# Altium project EBS_MainBoard.PrjPcb
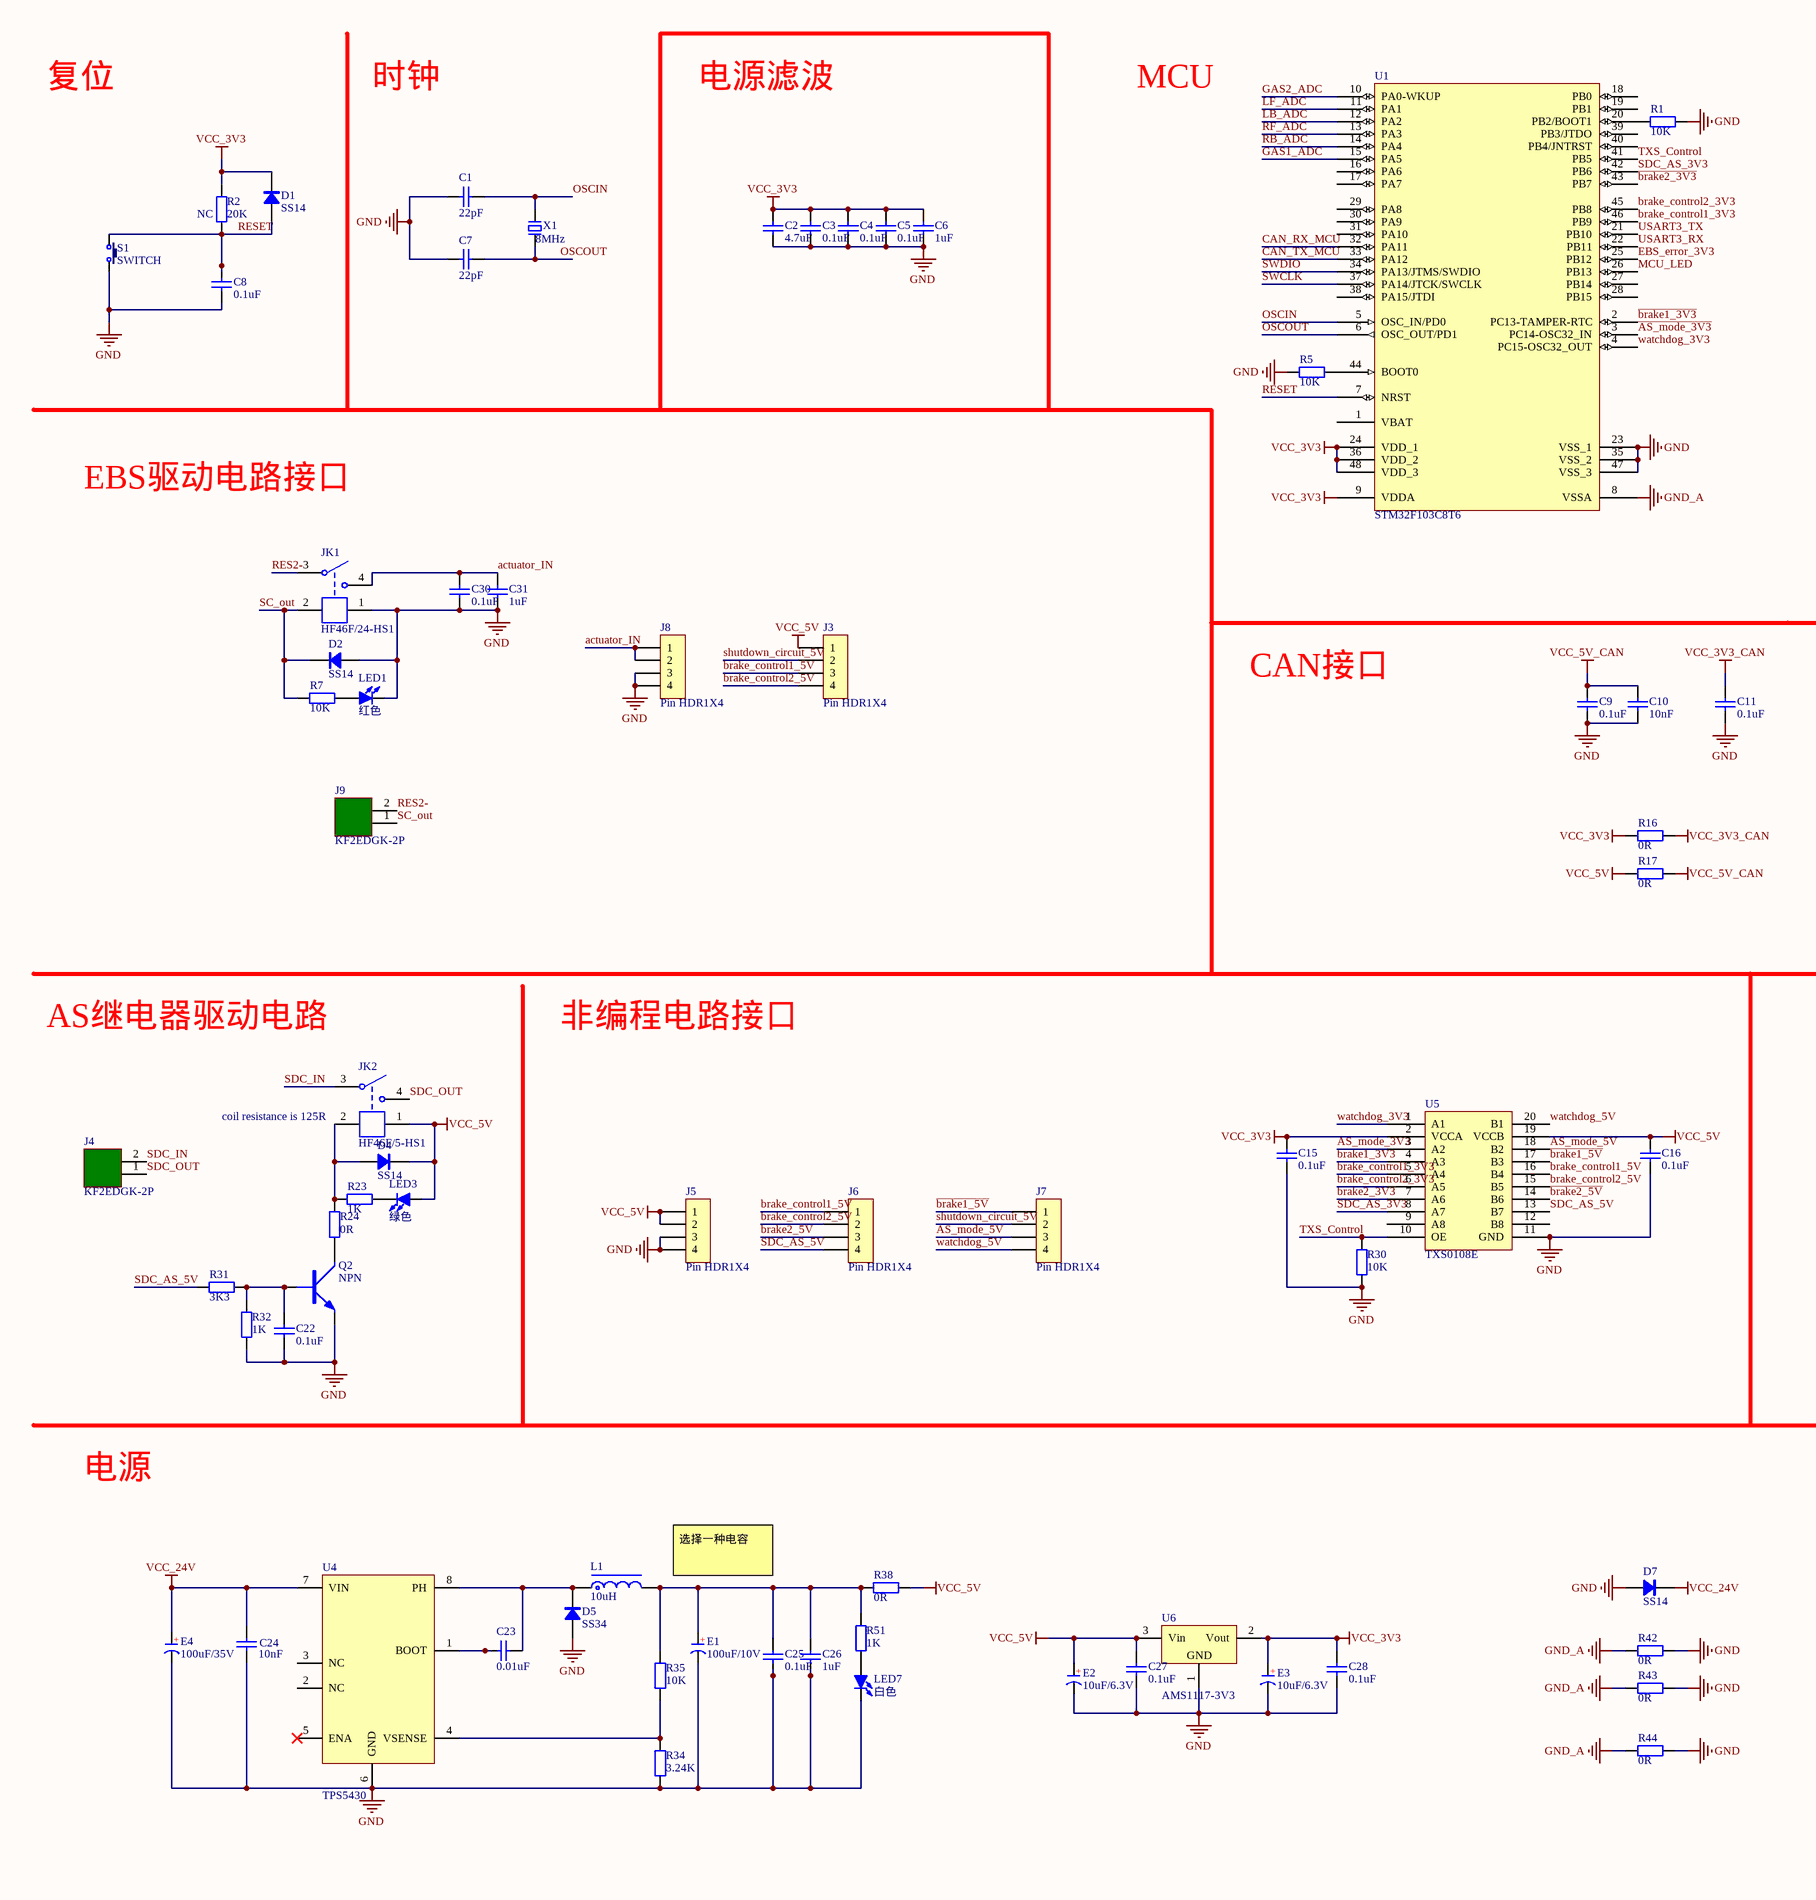
[diagram p0: HRT_23D_EBS1.1.SchDoc, left]
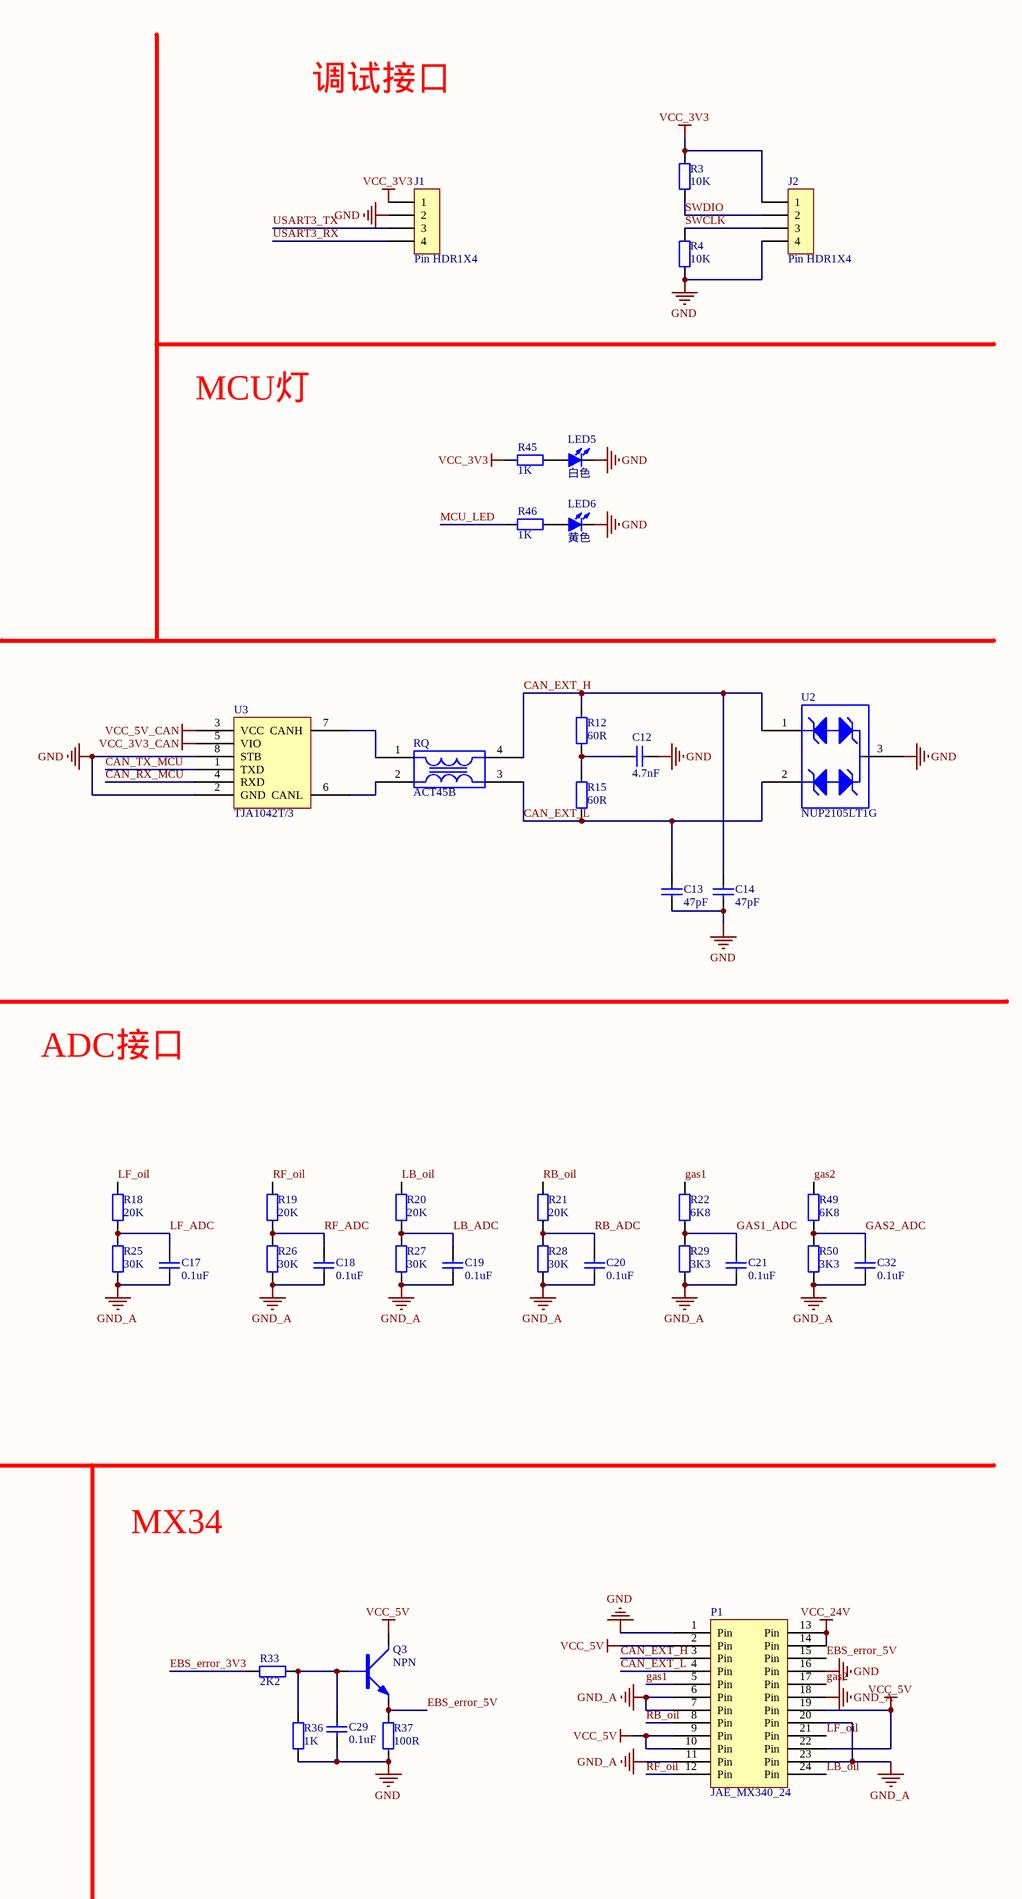
[diagram p1: HRT_23D_EBS1.1.SchDoc, right]
1 sheet, 109 parts. Net scope: global (net labels, ports and power ports of the same name join across sheets).
Board file: HRT_23D_EBS1.1.PcbDoc

## Sheet HRT_23D_EBS1.1.SchDoc
size A2

### Parts
C1  22pF  [C 0805_M]
C2  4.7uF  [C 0805_M]
C3  0.1uF  [C 0805_M]
C4  0.1uF  [C 0805_M]
C5  0.1uF  [C 0805_M]
C6  1uF  [C 0805_M]
C7  22pF  [C 0805_M]
C8  0.1uF  [C 0805_M]
C9  0.1uF  [C 0805_M]
C10  10nF  [C 0805_M]
C11  0.1uF  [C 0805_M]
C12  4.7nF  [C 0805_M]
C13  47pF  [C 0805_M]
C14  47pF  [C 0805_M]
C15  0.1uF  [C 0805_M]
C16  0.1uF  [C 0805_M]
C17  0.1uF  [C 0805_M]
C18  0.1uF  [C 0805_M]
C19  0.1uF  [C 0805_M]
C20  0.1uF  [C 0805_M]
C21  0.1uF  [C 0805_M]
C22  0.1uF  [C 0805_M]
C23  0.01uF  [C 0805_M]
C24  10nF  [C 0805_M]
C25  0.1uF  [C 0805_M]
C26  1uF  [C 0805_M]
C27  0.1uF  [C 0805_M]
C28  0.1uF  [C 0805_M]
C29  0.1uF  [C 0805_M]
C30  0.1uF  [C 0805_M]
C31  1uF  [C 0805_M]
C32  0.1uF  [C 0805_M]
D1  SS14  [SMA]
D2  SS14  [SMA]
D4  SS14  [SMA]
D5  SS34  [SMA]
D7  SS14  [SMA]
E1  100uF/10V  [CM C(5*5.4)]
E2  10uF/6.3V  [CD A(3216)]
E3  10uF/6.3V  [CD A(3216)]
E4  100uF/35V  [CM D(6.3*7.7)]
J1  Pin HDR1X4  [Pin HDR1X4/2.54mm-S]
J2  Pin HDR1X4  [Pin HDR1X4/2.54mm-S]
J3  Pin HDR1X4  [Fe-HDR1X4/2.54-S]
J4  KF2EDGK-2P  [KF2EDGK5.08W-2P]
J5  Pin HDR1X4  [Fe-HDR1X4/2.54-S]
J6  Pin HDR1X4  [Fe-HDR1X4/2.54-S]
J7  Pin HDR1X4  [Fe-HDR1X4/2.54-S]
J8  Pin HDR1X4  [Fe-HDR1X4/2.54-S]
J9  KF2EDGK-2P  [KF2EDGK5.08W-2P]
JK1  HF46F/24-HS1  [HF46-xx-HS1]
JK2  HF46F/5-HS1  [HF46-xx-HS1]
L1  10uH  [SMD 12*12*8mm]
LED1  红色  [LED 0805R]
LED3  绿色  [LED 0805G]
LED5  白色  [LED 0805W]
LED6  黄色  [LED 0805Y]
LED7  白色  [LED 0805W]
P1  JAE_MX340_24  [JAE_MX34_2.2_24 - duplicate]
Q2  NPN  [SOT-23]
Q3  NPN  [SOT-23]
R1  10K  [0805R]
R2  20K  [0805R]
R3  10K  [0805R]
R4  10K  [0805R]
R5  10K  [0805R]
R7  10K  [0805R]
R12  60R  [0805R]
R15  60R  [0805R]
R16  0R  [0805R]
R17  0R  [0805R]
R18  20K  [0805R]
R19  20K  [0805R]
R20  20K  [0805R]
R21  20K  [0805R]
R22  6K8  [0805R]
R23  1K  [0805R]
R24  0R  [0805R]
R25  30K  [0805R]
R26  30K  [0805R]
R27  30K  [0805R]
R28  30K  [0805R]
R29  3K3  [0805R]
R30  10K  [0805R]
R31  3K3  [0805R]
R32  1K  [0805R]
R33  2K2  [0805R]
R34  3.24K  [0805R]
R35  10K  [0805R]
R36  1K  [0805R]
R37  100R  [0805R]
R38  0R  [1206R]
R42  0R  [0805R]
R43  0R  [0805R]
R44  0R  [0805R]
R45  1K  [0805R]
R46  1K  [0805R]
R49  6K8  [0805R]
R50  3K3  [0805R]
R51  1K  [0805R]
RQ  ACT45B  [4532]
S1  SWITCH  [TSW SMD-3*6*2.5]
U1  STM32F103C8T6  [LQFP48 7X7]
U2  NUP2105LT1G  [SOT-23-3P]
U3  TJA1042T/3  [SOP8]
U4  TPS5430  [SOP8-Pad]
U5  TXS0108E  [SSOP20]
U6  AMS1117-3V3  [SOT223_M]
X1  8MHz  [OSC 5032-2P]

### Nets
GND: C1.1 C2.1 C3.1 C4.1 C5.1 C6.1 C7.1 C8.1 C9.1 C10.1 C11.1 C12.1 C13.2 C14.2 C15.2 C16.2 C22.2 C24.2 C25.2 C26.2 C27.2 C28.2 C29.2 C30.2 C31.2 D2.1(A) D5.1(A) D7.1(A) E1.2(K) E2.1(K) E3.1(K) E4.2(K) J1.2 J2.4 J5.3 J5.4 J8.3 J8.4 JK1.1 LED1.2(K) LED5.2(K) LED6.2(K) LED7.2(K) P1.1(Pin) P1.16(Pin) Q2.E R1.1 R4.1 R5.1 R30.1 R32.1 R34.1 R36.1 R37.1 R42.1 R43.1 R44.1 S1.2 U1.23(VSS_1) U1.35(VSS_2) U1.47(VSS_3) U2.3 U3.2(GND) U3.8(STB) U4.6(GND) U5.11(GND) U6.1(GND)
GND_A: C17.2 C18.2 C19.2 C20.2 C21.2 C32.2 P1.6(Pin) P1.7(Pin) P1.11(Pin) P1.18(Pin) P1.20(Pin) P1.23(Pin) R25.1 R26.1 R27.1 R28.1 R29.1 R42.2 R43.2 R44.2 R50.1 U1.8(VSSA)
VCC_3V3: C2.2 C3.2 C4.2 C5.2 C6.2 C15.1 C28.1 D1.2(K) E3.2(A) J1.1 J2.1 R2.2 R3.2 R16.1 R45.2 U1.9(VDDA) U1.24(VDD_1) U1.36(VDD_2) U1.48(VDD_3) U5.2(VCCA) U6.2(Vout)
VCC_3V3_CAN: C11.2 R16.2 U3.5(VIO)
VCC_5V: C16.1 C27.1 D4.2(K) E2.2(A) J3.1 J5.1 J5.2 JK2.1 LED3.1(A) P1.2(Pin) P1.9(Pin) P1.10(Pin) P1.19(Pin) P1.22(Pin) Q3.C R17.1 R38.1 U5.19(VCCB) U6.3(Vin)
VCC_5V_CAN: C9.2 C10.2 R17.2 U3.3(VCC)
VCC_24V: C24.1 D7.2(K) E4.1(A) P1.13(Pin) P1.14(Pin) U4.7(VIN)
~{AS_mode_3V3}: U1.3(PC14-OSC32_IN) U5.3(A2)
~{AS_mode_5V}: J7.3 U5.18(B2)
actuator_IN: C30.1 C31.1 J8.1 J8.2 JK1.4
~{brake1_3V3}: U1.2(PC13-TAMPER-RTC) U5.4(A3)
~{brake1_5V}: J7.1 U5.17(B3)
~{brake2_3V3}: U1.43(PB7) U5.7(A6)
~{brake2_5V}: J6.3 U5.14(B6)
brake_control1_3V3: U1.46(PB9) U5.5(A4)
brake_control1_5V: J3.3 J6.1 U5.16(B4)
brake_control2_3V3: U1.45(PB8) U5.6(A5)
brake_control2_5V: J3.4 J6.2 U5.15(B5)
CAN_EXT_H: C14.1 P1.3(Pin) R12.2 RQ.4 U2.1
CAN_EXT_L: C13.1 P1.4(Pin) R15.1 RQ.3 U2.2
CAN_RX_MCU: U1.32(PA11) U3.4(RXD)
CAN_TX_MCU: U1.33(PA12) U3.1(TXD)
EBS_error_3V3: R33.2 U1.25(PB12)
EBS_error_5V: P1.15(Pin) Q3.E R37.2
gas1: P1.5(Pin) R22.2
GAS1_ADC: C21.1 R22.1 R29.2 U1.15(PA5)
gas2: P1.17(Pin) R49.2
GAS2_ADC: C32.1 R49.1 R50.2 U1.10(PA0-WKUP)
LB_ADC: C19.1 R20.1 R27.2 U1.12(PA2)
LB_oil: P1.24(Pin) R20.2
LF_ADC: C17.1 R18.1 R25.2 U1.11(PA1)
LF_oil: P1.21(Pin) R18.2
MCU_LED: R46.2 U1.26(PB13)
OSCIN: C1.2 U1.5(OSC_IN/PD0) X1.1
OSCOUT: C7.2 U1.6(OSC_OUT/PD1) X1.2
RB_ADC: C20.1 R21.1 R28.2 U1.14(PA4)
RB_oil: P1.8(Pin) R21.2
RES2-: J9.2 JK1.3
RESET: C8.2 D1.1(A) R2.1 S1.1 U1.7(NRST)
RF_ADC: C18.1 R19.1 R26.2 U1.13(PA3)
RF_oil: P1.12(Pin) R19.2
SC_out: D2.2(K) J9.1 JK1.2 R7.2
SDC_AS_3V3: U1.42(PB6) U5.8(A7)
SDC_AS_5V: J6.4 R31.2 U5.13(B7)
SDC_IN: J4.2 JK2.3
SDC_OUT: J4.1 JK2.4
shutdown_circuit_5V: J3.2 J7.2
SWCLK: J2.3 R4.2 U1.37(PA14/JTCK/SWCLK)
SWDIO: J2.2 R3.1 U1.34(PA13/JTMS/SWDIO)
TXS_Control: R30.2 U1.41(PB5) U5.10(OE)
USART3_RX: J1.4 U1.22(PB11)
USART3_TX: J1.3 U1.21(PB10)
watchdog_3V3: U1.4(PC15-OSC32_OUT) U5.1(A1)
watchdog_5V: J7.4 U5.20(B1)
NetC12_2: C12.2 R12.1 R15.2
NetC22_1: C22.1 Q2.B R31.1 R32.2
NetC23_1: C23.1 U4.1(BOOT)
NetC23_2: C23.2 D5.2(K) L1.1 U4.8(PH)
NetC25_1: C25.1 C26.1 E1.1(A) L1.2 R35.2 R38.2 R51.2
NetC29_1: C29.1 Q3.B R33.1 R36.2
NetD4_1: D4.1(A) JK2.2 R23.2 R24.1
NetLED1_1: LED1.1(A) R7.1
NetLED3_2: LED3.2(K) R23.1
NetLED5_1: LED5.1(A) R45.1
NetLED6_1: LED6.1(A) R46.1
NetLED7_1: LED7.1(A) R51.1
NetQ2_C: Q2.C R24.2
NetR1_2: R1.2 U1.20(PB2/BOOT1)
NetR5_2: R5.2 U1.44(BOOT0)
NetR34_2: R34.2 R35.1 U4.4(VSENSE)
NetRQ_1: RQ.1 U3.7(CANH)
NetRQ_2: RQ.2 U3.6(CANL)

Not connected (* = marked no-connect by the designer): U1 1(VBAT) 16(PA6) 17(PA7) 18(PB0) 19(PB1) 27(PB14) 28(PB15) 29(PA8) 30(PA9) 31(PA10) 38(PA15/JTDI) 39(PB3/JTDO) 40(PB4/JNTRST); U4 2(NC) 3(NC) 5(ENA)*; U5 9(A8) 12(B8)

### Notes on the sheet
- 复位
- 时钟
- 电源滤波
- MCU
- 调试接口
- (near R2) NC
- MCU灯
- EBS驱动电路接口
- CAN接口
- AS继电器驱动电路
- 非编程电路接口
- ADC接口
- (near JK2) coil resistance is 125R
- 电源
- MX34
- (near L1) 选择一种电容
- (in symbol C-CD) +
- (in symbol C-CM) +

### Library data of the parts
C1-C32 = C: 无极性贴片电容
D1 D2 D4 D7 = SS14: 肖特基二极管; 版权归属: 源创客; 属性: 40V/1A; BOM名称: 肖特基二极管; 学习资源: www.ooocke.com
D5 = SS34: 肖特基二极管; 版权归属: 源创客; 属性: 40V/3A; BOM名称: 肖特基二极管; 学习资源: www.ooocke.com
E1 E4 = C-CM: 贴片电解电容 / ESR < 0.04R; 版权归属: 源创客; BOM名称: 贴片电解电容; 学习资源: www.ooocke.com
E2 E3 = C-CD: 贴片钽电容; 版权归属: 源创客; BOM名称: 贴片钽电容; 学习资源: www.ooocke.com
JK1 = HF46F/24-HS1: 24V一组常开继电器; BOM名称: 24V继电器; 版权归属: 源创客; 学习资源: www.ooocke.com
JK2 = HF46F/5-HS1: 5V一组常开; BOM名称: 5V继电器; 版权归属: 源创客; 学习资源: www.ooocke.com
L1 = L-CD: 贴片功率电感; BOM名称: 功率电感; 版权归属: 源创客; 学习资源: www.ooocke.com
LED1 LED3 LED5-LED7 = LED-SMD: 贴片LED; 版权归属: 源创客; BOM名称: 贴片LED; 学习资源: www.ooocke.com
P1 = JAE_MX34024NF1
Q2 Q3 = NPN: NPN三极管
R1-R5 R7 R12 R15-R38 R42-R46 R49-R51 = RES: 贴片电阻
RQ = ACT45B: 共模电感
S1 = SWITCH: 按键
U2 = NUP2105LT1G: 静电管
U3 = TJA1042T/3: 高速CAN收发器
U4 = TPS5430: DCDC降压芯片
U6 = AMS1117: 三端稳压芯片; BOM名称: 稳压芯片; 版权归属: 源创客; 学习资源: www.ooocke.com
X1 = XTAL-2P: 两脚无源晶振